# EasyEDA Pro project XRAY.epro, board PCB8_1
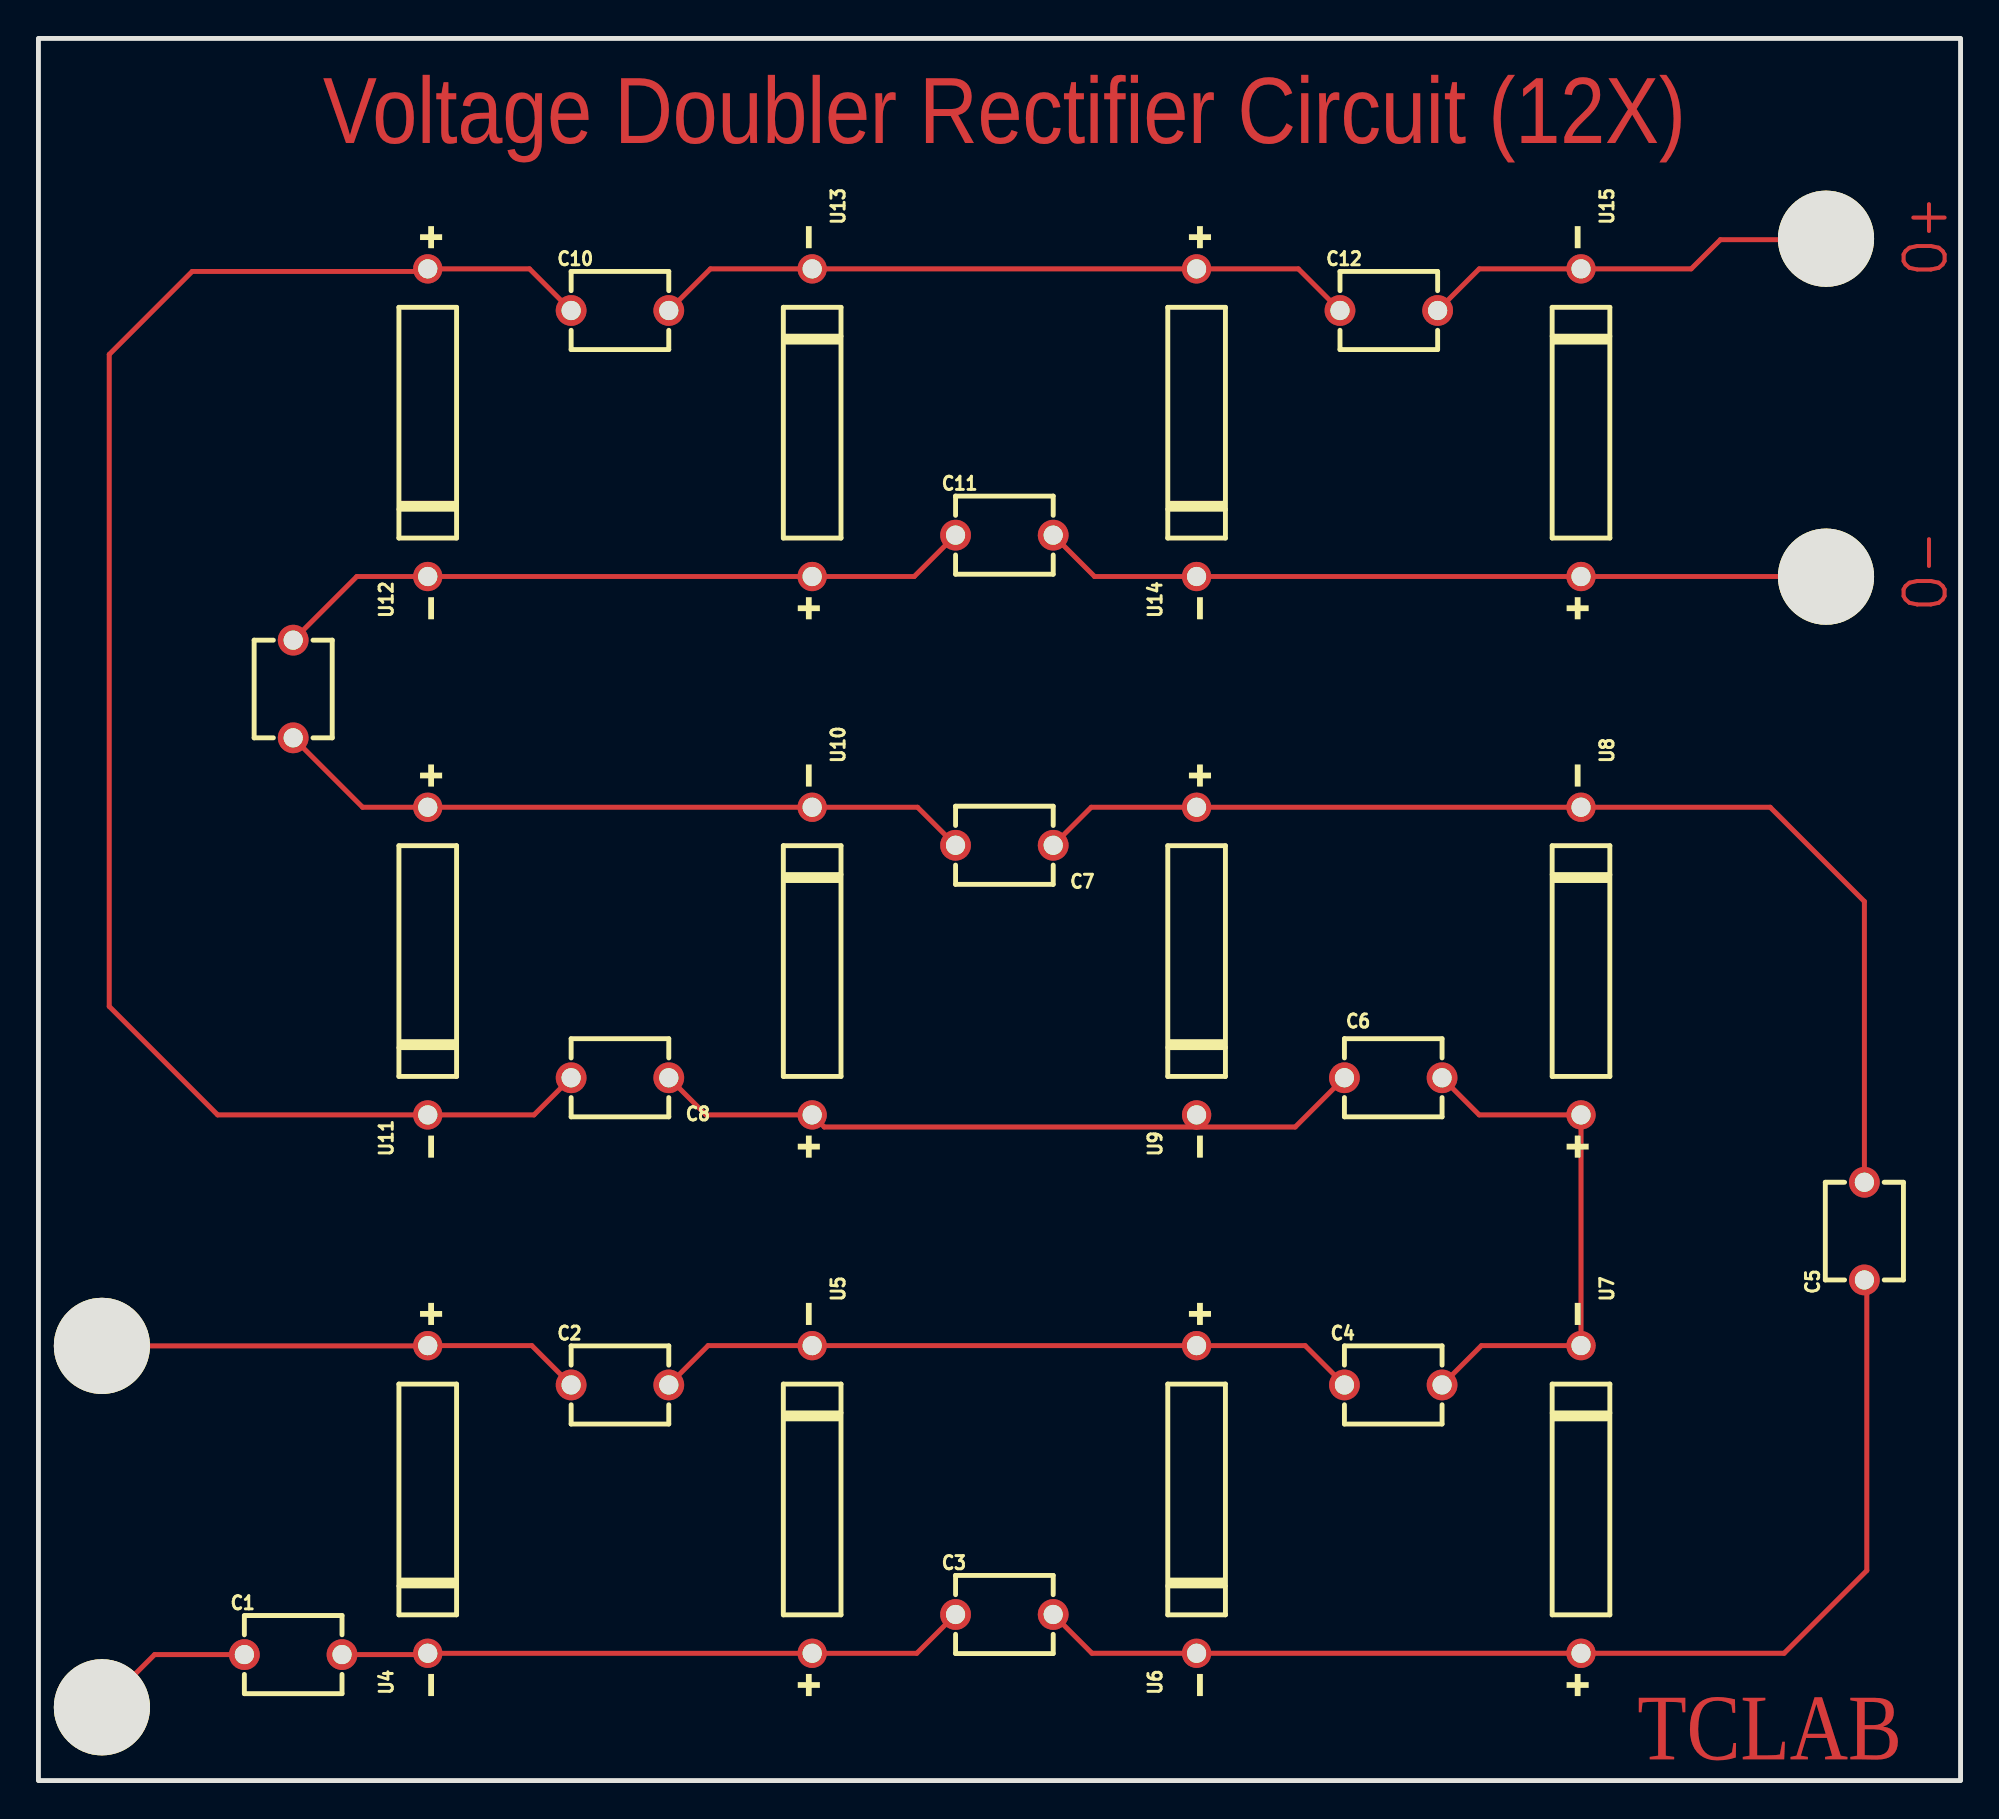
[diagram p11: board, top side]
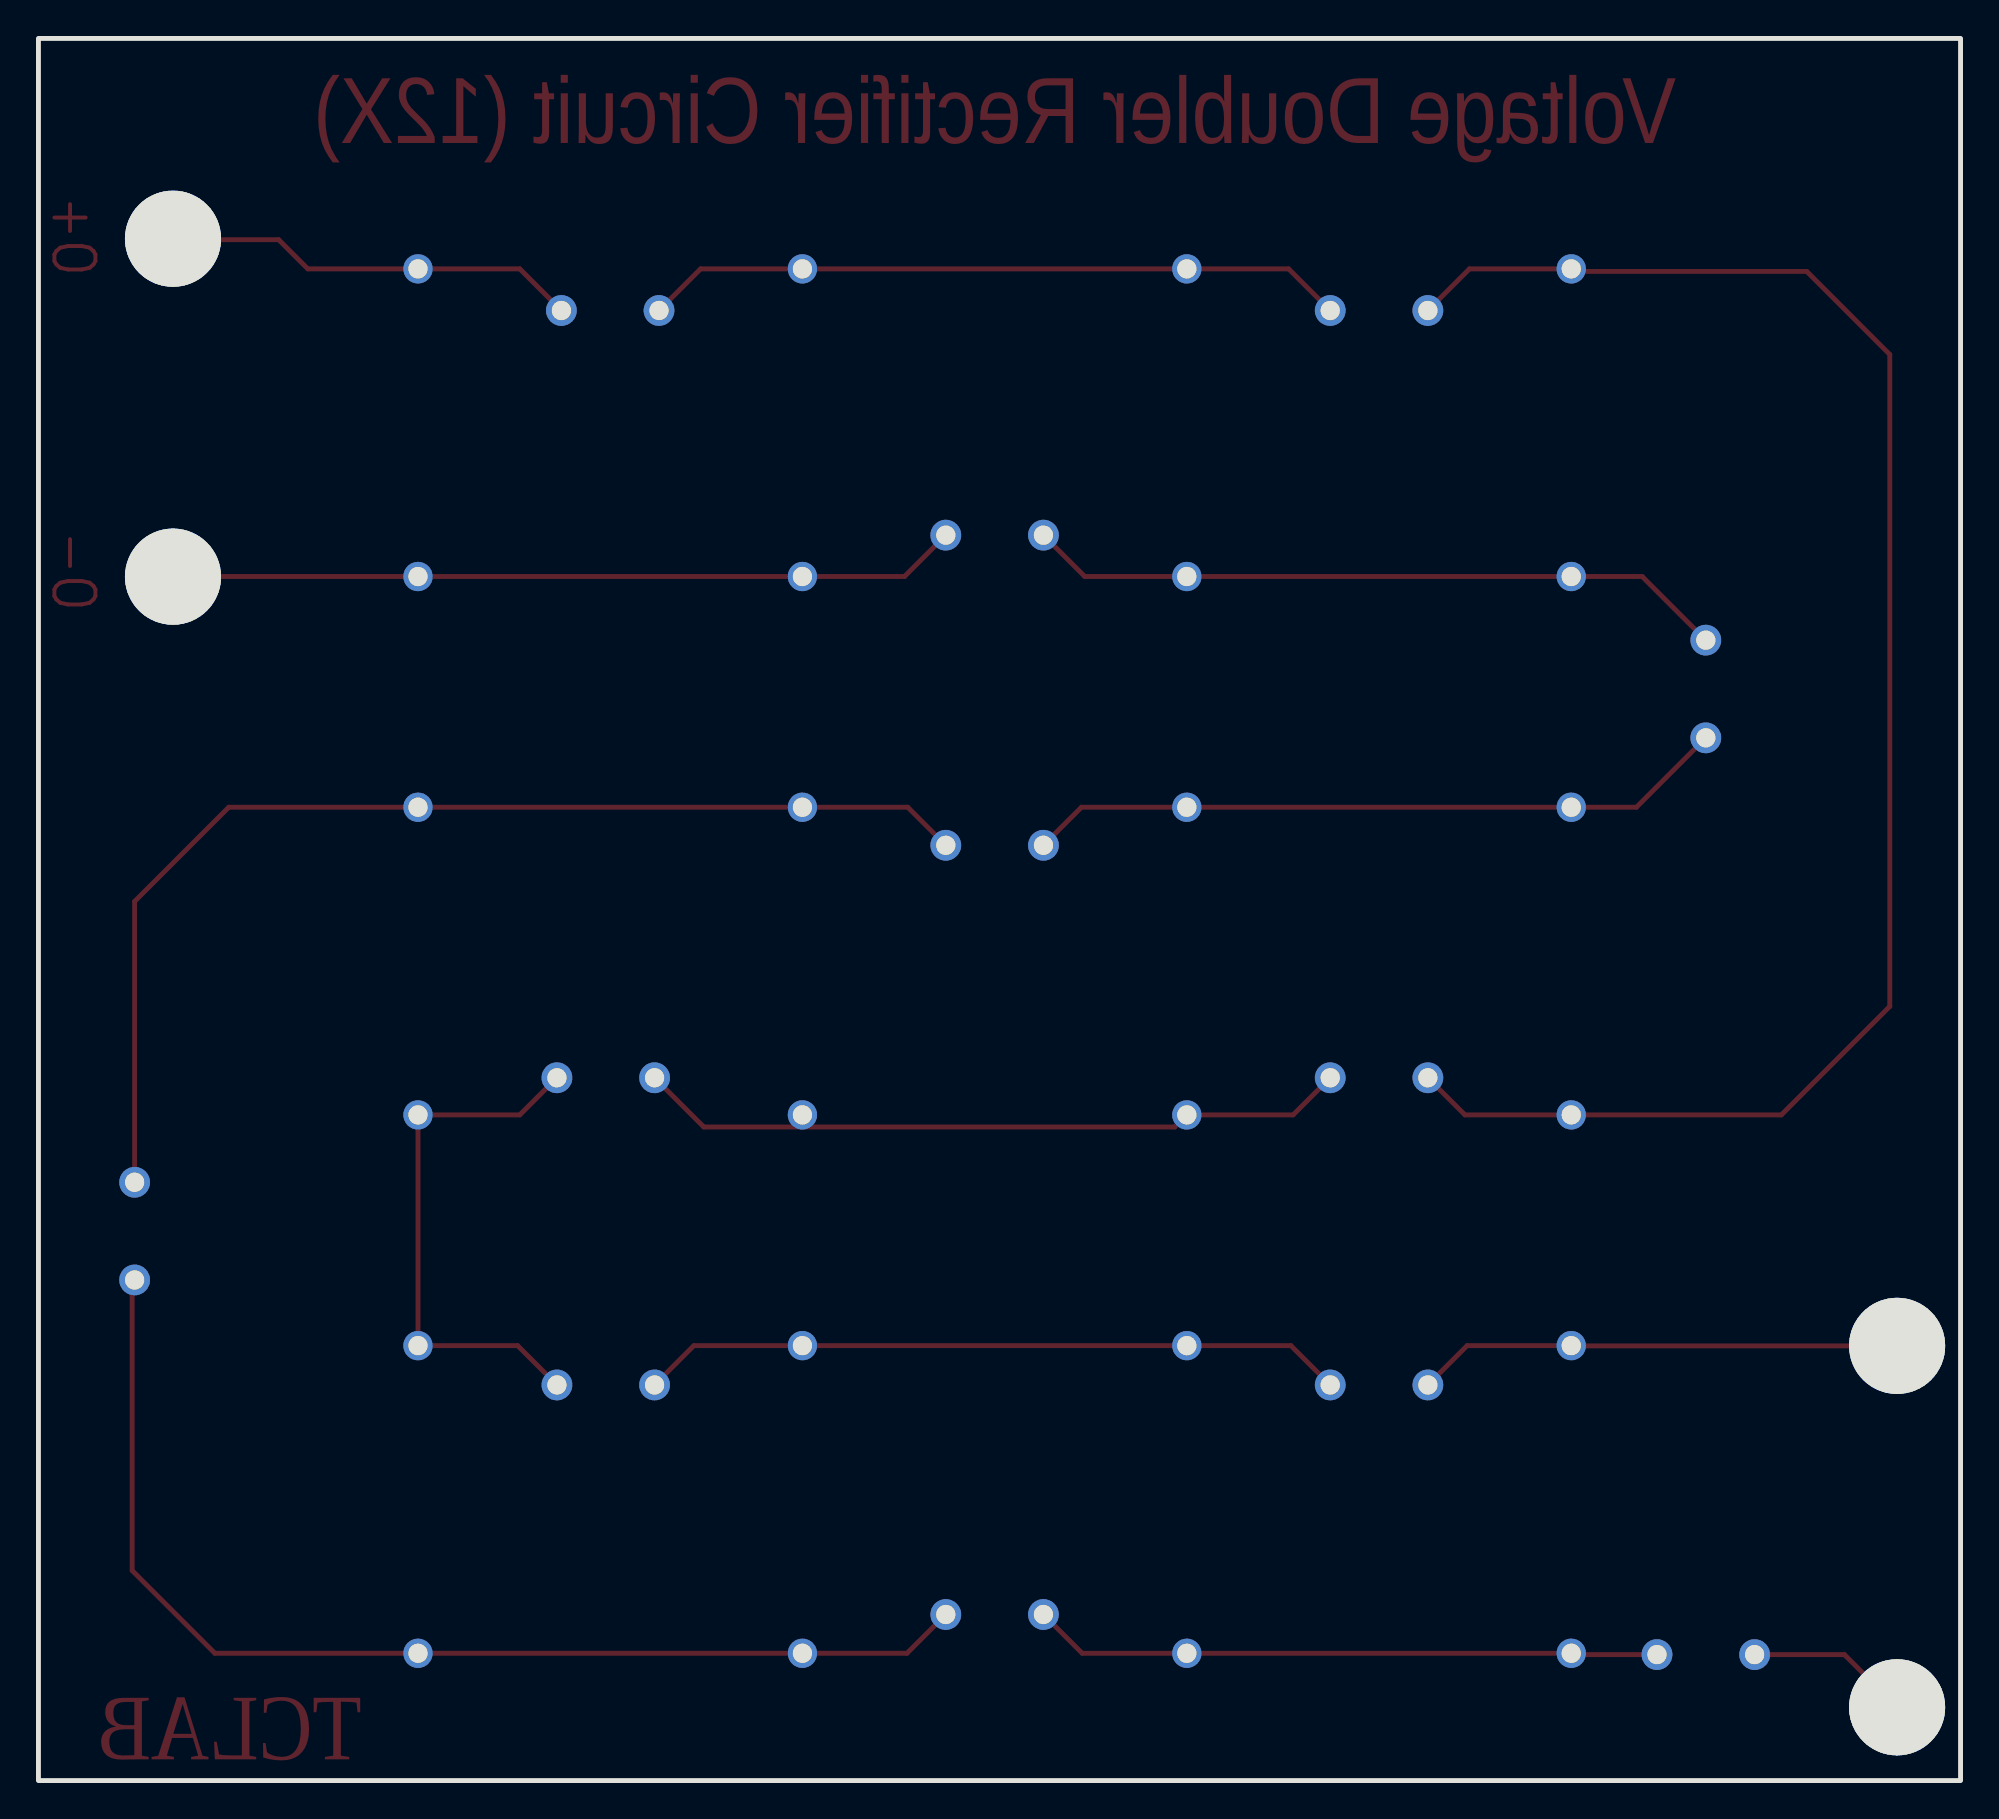
[diagram p12: board, bottom side, seen from below]

Outline 100 x 90.6 mm; copper layers: Top Layer, Bottom Layer. Coordinates in mm from the lower left corner of the outline.
Outline path: rectangle 0,90.6 100,0
Stack: Top Layer 0.035mm / Dielectric1 1.51mm FR4 er 4.5 / Bottom Layer 0.035mm

## Design rules (mm)
template: JLCPCB Capability(Two Layers Board)
spacing copperThickness1oz (default): track to track 0.102, other pairs 0.152 to 0.3
spacing copperThickness2oz: track to track 0.203, other pairs 0.152 to 0.3
track width copperThickness1oz (default): min 0.127, default 0.254, max 2.54
track width copperThickness2oz: min 0.203, default 0.254, max 2.54
differential pair differentialPair (default): width min 0.127, default 0.254, max 2.54; gap min 0.152, default 0.152
via viaSize (default): diameter min 0.5, default 0.61, max 10; hole min 0.3, default 0.305, max 6.3

## Placement (name value [footprint] x y rotation side)
C1  30KV102K  [CAP-TH_L5.0-W4.0-P5.00-D1.0]  13.25 6.55 0 top
C2  30KV102K  [CAP-TH_L5.0-W4.0-P5.00-D1.0]  30.25 20.57 0 top
C3  30KV102K  [CAP-TH_L5.0-W4.0-P5.00-D1.0]  50.25 8.64 0 top
C4  30KV102K  [CAP-TH_L5.0-W4.0-P5.00-D1.0]  70.48 20.57 0 top
C5  30KV102K  [CAP-TH_L5.0-W4.0-P5.00-D1.0]  95 28.58 90 top
C6  30KV102K  [CAP-TH_L5.0-W4.0-P5.00-D1.0]  70.48 36.55 180 top
C7  30KV102K  [CAP-TH_L5.0-W4.0-P5.00-D1.0]  50.25 48.64 180 top
C8  30KV102K  [CAP-TH_L5.0-W4.0-P5.00-D1.0]  30.25 36.55 180 top
C9  30KV102K  [CAP-TH_L5.0-W4.0-P5.00-D1.0]  13.25 56.77 90 top
C10  30KV102K  [CAP-TH_L5.0-W4.0-P5.00-D1.0]  30.25 76.45 0 top
C11  30KV102K  [CAP-TH_L5.0-W4.0-P5.00-D1.0]  50.25 64.77 0 top
C12  30KV102K  [CAP-TH_L5.0-W4.0-P5.00-D1.0]  70.25 76.45 0 top
NOREF  -  [Pad_e39]  3.3 22.61 0 top
NOREF#2  -  [Pad_e38]  93 62.61 0 top
NOREF#3  -  [Pad_e35]  93 80.19 0 top
NOREF#4  -  [Pad_e34]  3.3 3.81 0 top
U4  2CL77  [DIO-TH_BD3.0-L12.0-P16.00-D0.6]  20.25 14.62 90 top
U5  2CL77  [DIO-TH_BD3.0-L12.0-P16.00-D0.6]  40.25 14.62 270 top
U6  2CL77  [DIO-TH_BD3.0-L12.0-P16.00-D0.6]  60.25 14.62 90 top
U7  2CL77  [DIO-TH_BD3.0-L12.0-P16.00-D0.6]  80.25 14.62 270 top
U8  2CL77  [DIO-TH_BD3.0-L12.0-P16.00-D0.6]  80.25 42.62 270 top
U9  2CL77  [DIO-TH_BD3.0-L12.0-P16.00-D0.6]  60.25 42.62 90 top
U10  2CL77  [DIO-TH_BD3.0-L12.0-P16.00-D0.6]  40.25 42.62 270 top
U11  2CL77  [DIO-TH_BD3.0-L12.0-P16.00-D0.6]  20.25 42.62 90 top
U12  2CL77  [DIO-TH_BD3.0-L12.0-P16.00-D0.6]  20.25 70.62 90 top
U13  2CL77  [DIO-TH_BD3.0-L12.0-P16.00-D0.6]  40.25 70.62 270 top
U14  2CL77  [DIO-TH_BD3.0-L12.0-P16.00-D0.6]  60.25 70.62 90 top
U15  2CL77  [DIO-TH_BD3.0-L12.0-P16.00-D0.6]  80.25 70.62 270 top

## Footprints (pads in the part's own frame, mm; a bottom-side part is the same pattern mirrored in y, then rotated)
CAP-TH_L5.0-W4.0-P5.00-D1.0
  round 1.6 hole 1: 1(-2.54,0) 2(2.54,0)
DIO-TH_BD3.0-L12.0-P16.00-D0.6
  round 1.524 hole 1: 1(-8,0) 2(8,0)
Pad_e34
  round 5 hole 5x1.524: 3(0,0)
Pad_e35
  round 5 hole 5x1.524: 3(0,0)
Pad_e38
  round 5 hole 5x1.524: 3(0,0)
Pad_e39
  round 5 hole 5x1.524: 3(0,0)

## Nets
$1N855: C2.2 C4.1 U5.1 U6.2
$1N856: C1.2 C3.1 U4.1 U5.2
$1N857: C4.2 C6.1 U7.1 U8.2
$1N858: C3.2 C5.1 U6.1 U7.2
$1N859: C6.2 C8.1 U9.1 U10.2
$1N860: C5.2 C7.1 U8.1 U9.2
$1N861: C8.2 C10.1 U11.1 U12.2
$1N862: C7.2 C9.1 U10.1 U11.2
$1N863: C10.2 C12.1 U13.1 U14.2
$1N864: C9.2 C11.1 U12.1 U13.2
$1N865: C2.1 NOREF.3 U4.2
$1N866: C1.1 NOREF#4.3
$1N1481: C12.2 NOREF#3.3 U15.1
$1N1482: C11.2 NOREF#2.3 U14.1 U15.2

## Routing (per net, layer and track width the routed paths; a pad name or vN(x,y) marks a point on that pad's centre or on a via; arc(x,y) is an arc through that point)
$1N855: length 36.8
  Top Layer w0.254: C2.2 34.84,22.62 U5.1 U6.2 65.9,22.62 C4.1
$1N856: length 32.8
  Top Layer w0.254: C1.2 20.19,6.55 U4.1 U5.2 45.7,6.62 C3.1
$1N857: length 28.1
  Top Layer w0.254: C4.2 75.07,22.62 U7.1 U8.2 74.96,34.62 C6.1
$1N858: length 60.1
  Top Layer w0.254: C3.2 54.81,6.62 U6.1 U7.2 90.82,6.62 95.12,10.92 95.12,25.91 C5.1
$1N859: length 37.9
  Top Layer w0.254: U9.1 60.25,33.99 ; 60.25,33.99 65.38,33.99 C6.2 ; 60.25,33.99 40.88,33.99 U10.2 34.73,34.62 C8.1
$1N860: length 59.7
  Top Layer w0.254: C5.2 95,45.72 90.1,50.62 U8.1 U9.2 54.77,50.62 C7.1
$1N861: length 87.8
  Top Layer w0.254: C8.2 25.78,34.62 U11.1 9.32,34.62 3.68,40.26 3.68,74.17 8,78.49 20.12,78.49 U12.2 25.55,78.62 C10.1
$1N862: length 36.8
  Top Layer w0.254: C7.2 45.74,50.62 U10.1 U11.2 16.86,50.62 C9.1
$1N863: length 36.7
  Top Layer w0.254: C12.1 65.55,78.62 U14.2 U13.1 34.96,78.62 C10.2
$1N864: length 36.7
  Top Layer w0.254: C11.1 45.56,62.62 U13.2 U12.1 16.56,62.62 C9.2
$1N865: length 25.3
  Top Layer w0.254: NOREF.3 20.24,22.61 U4.2 25.67,22.62 C2.1
$1N866: length 8.5
  Top Layer w0.254: C1.1 6.04,6.55 NOREF#4.3
$1N1481: length 21.8
  Top Layer w0.254: NOREF#3.3 92.95,80.14 87.5,80.14 85.98,78.62 U15.1 74.96,78.62 C12.2
$1N1482: length 41.1
  Top Layer w0.254: NOREF#2.3 92.99,62.62 U15.2 U14.1 54.95,62.62 C11.2

## Text on the board
Top Layer: O+ | O- | Voltage Doubler Rectifier Circuit (12X) | TCLAB
